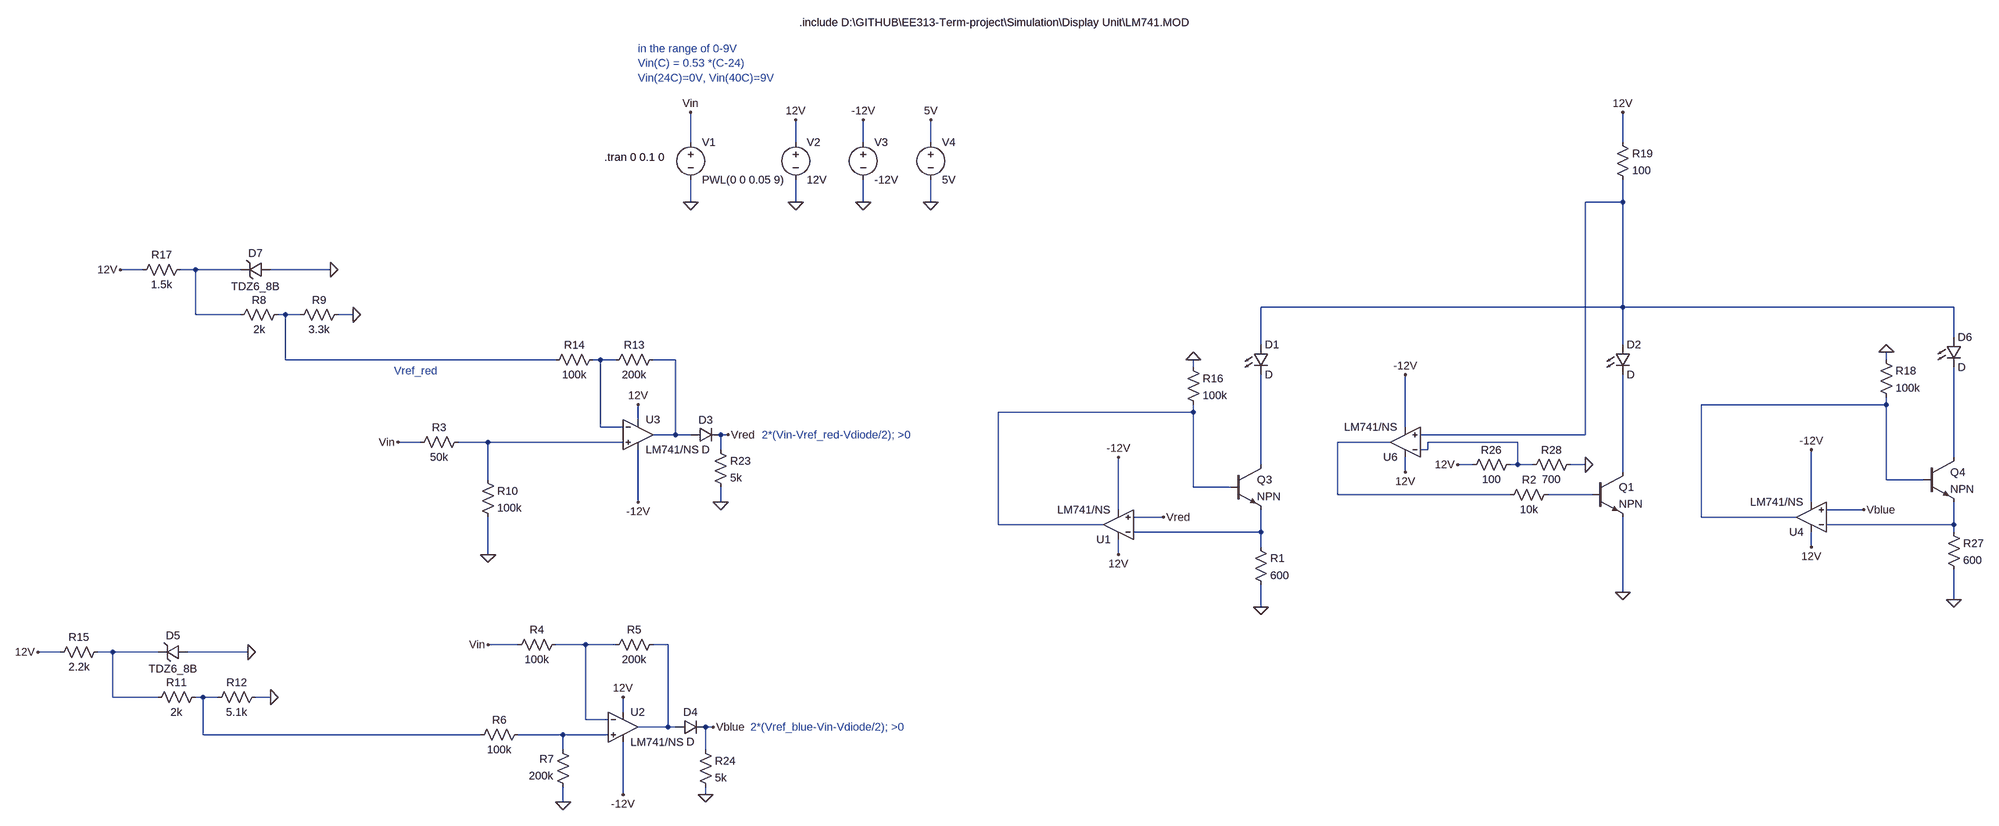
[diagram p0: schematic Display Unit.asc]
Display Unit.asc, the LTspice schematic file:
Version 4
SHEET 1 4272 2752
WIRE -912 320 -912 256
WIRE -688 320 -688 272
WIRE -544 320 -544 272
WIRE -400 320 -400 272
WIRE 1104 320 1104 256
WIRE -912 448 -912 400
WIRE -688 448 -688 400
WIRE -544 448 -544 400
WIRE -400 448 -400 400
WIRE 1104 448 1104 400
WIRE 1104 448 1024 448
WIRE -2080 592 -2128 592
WIRE -1968 592 -2000 592
WIRE -1872 592 -1968 592
WIRE -1680 592 -1808 592
WIRE 1104 672 1104 448
WIRE 1104 672 304 672
WIRE 2000 672 1104 672
WIRE -1968 688 -1968 592
WIRE -1872 688 -1968 688
WIRE -1776 688 -1792 688
WIRE -1744 688 -1776 688
WIRE -1632 688 -1664 688
WIRE 2000 736 2000 672
WIRE 304 752 304 672
WIRE 1104 752 1104 672
WIRE -1776 784 -1776 688
WIRE -1200 784 -1776 784
WIRE -1104 784 -1120 784
WIRE -1072 784 -1104 784
WIRE -944 784 -992 784
WIRE 1856 784 1856 768
WIRE 160 800 160 784
WIRE 1856 880 1856 864
WIRE 1856 880 1440 880
WIRE 160 896 160 880
WIRE 160 896 -256 896
WIRE -1024 912 -1024 880
WIRE -1104 928 -1104 784
WIRE -1056 928 -1104 928
WIRE 640 928 640 816
WIRE -944 944 -944 784
WIRE -944 944 -992 944
WIRE -912 944 -944 944
WIRE -832 944 -848 944
WIRE 1024 944 1024 448
WIRE 1024 944 672 944
WIRE -1488 960 -1536 960
WIRE -1344 960 -1408 960
WIRE -1056 960 -1344 960
WIRE 608 960 496 960
WIRE 880 960 688 960
WIRE -848 976 -848 944
WIRE 688 976 688 960
WIRE 688 976 672 976
WIRE 2000 992 2000 800
WIRE 304 1008 304 816
WIRE 784 1008 752 1008
WIRE 880 1008 880 960
WIRE 880 1008 864 1008
WIRE 912 1008 880 1008
WIRE 1024 1008 992 1008
WIRE 640 1024 640 992
WIRE 1104 1024 1104 816
WIRE -1344 1040 -1344 960
WIRE 1856 1040 1856 880
WIRE 1936 1040 1856 1040
WIRE 160 1056 160 896
WIRE 240 1056 160 1056
WIRE 496 1072 496 960
WIRE 864 1072 496 1072
WIRE 1040 1072 944 1072
WIRE -1024 1088 -1024 976
WIRE -848 1088 -848 1056
WIRE 1696 1088 1696 976
WIRE 0 1104 0 992
WIRE 1808 1104 1728 1104
WIRE 96 1120 32 1120
WIRE 1440 1120 1440 880
WIRE 1664 1120 1440 1120
WIRE -256 1136 -256 896
WIRE -32 1136 -256 1136
WIRE 2000 1136 2000 1088
WIRE 2000 1136 1728 1136
WIRE 304 1152 304 1104
WIRE 304 1152 32 1152
WIRE 2000 1152 2000 1136
WIRE 304 1184 304 1152
WIRE 1696 1184 1696 1152
WIRE -1344 1200 -1344 1120
WIRE 0 1200 0 1168
WIRE 1104 1280 1104 1120
WIRE 2000 1296 2000 1232
WIRE 304 1312 304 1264
WIRE -1280 1392 -1344 1392
WIRE -1136 1392 -1200 1392
WIRE -1072 1392 -1136 1392
WIRE -960 1392 -992 1392
WIRE -2256 1408 -2304 1408
WIRE -2144 1408 -2176 1408
WIRE -2048 1408 -2144 1408
WIRE -1856 1408 -1984 1408
WIRE -2144 1504 -2144 1408
WIRE -2048 1504 -2144 1504
WIRE -1952 1504 -1968 1504
WIRE -1920 1504 -1952 1504
WIRE -1808 1504 -1840 1504
WIRE -1056 1536 -1056 1504
WIRE -1136 1552 -1136 1392
WIRE -1088 1552 -1136 1552
WIRE -960 1568 -960 1392
WIRE -960 1568 -1024 1568
WIRE -944 1568 -960 1568
WIRE -864 1568 -880 1568
WIRE -1952 1584 -1952 1504
WIRE -1360 1584 -1952 1584
WIRE -1184 1584 -1280 1584
WIRE -1088 1584 -1184 1584
WIRE -1184 1616 -1184 1584
WIRE -880 1616 -880 1568
WIRE -1056 1712 -1056 1600
WIRE -880 1712 -880 1696
WIRE -1184 1728 -1184 1696
FLAG -912 448 0
FLAG -912 256 Vin
FLAG -688 448 0
FLAG -688 272 12V
FLAG 304 1312 0
FLAG -544 448 0
FLAG -544 272 -12V
FLAG -400 448 0
FLAG -400 272 5V
FLAG -1024 880 12V
FLAG -1344 1200 0
FLAG -832 944 Vred
FLAG -1536 960 Vin
FLAG -1056 1504 12V
FLAG -864 1568 Vblue
FLAG -1184 1728 0
FLAG -1344 1392 Vin
FLAG -1024 1088 -12V
FLAG -1056 1712 -12V
FLAG 2000 1296 0
FLAG -848 1088 0
FLAG -880 1712 0
FLAG 1104 256 12V
FLAG -1632 688 0
FLAG -1680 592 0
FLAG -2128 592 12V
FLAG 0 1200 12V
FLAG 0 992 -12V
FLAG -1808 1504 0
FLAG -1856 1408 0
FLAG -2304 1408 12V
FLAG 96 1120 Vred
FLAG 160 784 0
FLAG 1696 1184 12V
FLAG 1696 976 -12V
FLAG 1856 768 0
FLAG 1808 1104 Vblue
FLAG 640 1024 12V
FLAG 640 816 -12V
FLAG 1024 1008 0
FLAG 752 1008 12V
FLAG 1104 1280 0
SYMBOL voltage -912 304 R0
WINDOW 123 0 0 Left 0
WINDOW 39 0 0 Left 0
SYMATTR InstName V1
SYMATTR Value PWL(0 0 0.05 9)
SYMBOL voltage -688 304 R0
WINDOW 123 0 0 Left 0
WINDOW 39 0 0 Left 0
SYMATTR InstName V2
SYMATTR Value 12V
SYMBOL LED 288 752 R0
SYMATTR InstName D1
SYMBOL voltage -544 304 R0
WINDOW 123 0 0 Left 0
WINDOW 39 0 0 Left 0
SYMATTR InstName V3
SYMATTR Value -12V
SYMBOL voltage -400 304 R0
WINDOW 123 0 0 Left 0
WINDOW 39 0 0 Left 0
SYMATTR InstName V4
SYMATTR Value 5V
SYMBOL OpAmps\\opamp2 -1024 880 R0
SYMATTR InstName U3
SYMATTR Value LM741/NS
SYMBOL res -1360 1024 R0
SYMATTR InstName R10
SYMATTR Value 100k
SYMBOL res -976 768 R90
WINDOW 0 0 56 VBottom 2
WINDOW 3 32 56 VTop 2
SYMATTR InstName R13
SYMATTR Value 200k
SYMBOL res -1216 800 R270
WINDOW 0 32 56 VTop 2
WINDOW 3 0 56 VBottom 2
SYMATTR InstName R14
SYMATTR Value 100k
SYMBOL res -1392 944 R90
WINDOW 0 0 56 VBottom 2
WINDOW 3 32 56 VTop 2
SYMATTR InstName R3
SYMATTR Value 50k
SYMBOL OpAmps\\opamp2 -1056 1504 R0
SYMATTR InstName U2
SYMATTR Value LM741/NS
SYMBOL LED 1088 752 R0
SYMATTR InstName D2
SYMBOL res -1184 1376 R90
WINDOW 0 0 56 VBottom 2
WINDOW 3 32 56 VTop 2
SYMATTR InstName R4
SYMATTR Value 100k
SYMBOL res -976 1376 R90
WINDOW 0 0 56 VBottom 2
WINDOW 3 32 56 VTop 2
SYMATTR InstName R5
SYMATTR Value 200k
SYMBOL res -1264 1568 R90
WINDOW 0 0 56 VBottom 2
WINDOW 3 32 56 VTop 2
SYMATTR InstName R6
SYMATTR Value 100k
SYMBOL res -1168 1712 R180
WINDOW 0 36 76 Left 2
WINDOW 3 36 40 Left 2
SYMATTR InstName R7
SYMATTR Value 200k
SYMBOL diode -912 960 R270
WINDOW 0 32 32 VTop 2
WINDOW 3 0 32 VBottom 2
SYMATTR InstName D3
SYMBOL diode -944 1584 R270
WINDOW 0 32 32 VTop 2
WINDOW 3 0 32 VBottom 2
SYMATTR InstName D4
SYMBOL LED 1984 736 R0
SYMATTR InstName D6
SYMBOL res 1984 1136 R0
SYMATTR InstName R27
SYMATTR Value 600
SYMBOL res -864 960 R0
SYMATTR InstName R23
SYMATTR Value 5k
SYMBOL res -896 1600 R0
SYMATTR InstName R24
SYMATTR Value 5k
SYMBOL zener -1808 576 R90
WINDOW 0 -4 32 VBottom 2
WINDOW 3 36 32 VTop 2
SYMATTR InstName D7
SYMATTR Value TDZ6_8B
SYMBOL res -1776 672 R90
WINDOW 0 0 56 VBottom 2
WINDOW 3 32 56 VTop 2
SYMATTR InstName R8
SYMATTR Value 2k
SYMBOL res -1648 672 R90
WINDOW 0 0 56 VBottom 2
WINDOW 3 32 56 VTop 2
SYMATTR InstName R9
SYMATTR Value 3.3k
SYMBOL res -1984 576 R90
WINDOW 0 0 56 VBottom 2
WINDOW 3 32 56 VTop 2
SYMATTR InstName R17
SYMATTR Value 1.5k
SYMBOL OpAmps\\opamp2 0 1200 R180
SYMATTR InstName U1
SYMATTR Value LM741/NS
SYMBOL zener -1984 1392 R90
WINDOW 0 -4 32 VBottom 2
WINDOW 3 36 32 VTop 2
SYMATTR InstName D5
SYMATTR Value TDZ6_8B
SYMBOL res -1952 1488 R90
WINDOW 0 0 56 VBottom 2
WINDOW 3 32 56 VTop 2
SYMATTR InstName R11
SYMATTR Value 2k
SYMBOL res -1824 1488 R90
WINDOW 0 0 56 VBottom 2
WINDOW 3 32 56 VTop 2
SYMATTR InstName R12
SYMATTR Value 5.1k
SYMBOL res -2160 1392 R90
WINDOW 0 0 56 VBottom 2
WINDOW 3 32 56 VTop 2
SYMATTR InstName R15
SYMATTR Value 2.2k
SYMBOL res 144 784 R0
SYMATTR InstName R16
SYMATTR Value 100k
SYMBOL OpAmps\\opamp2 1696 1184 R180
SYMATTR InstName U4
SYMATTR Value LM741/NS
SYMBOL res 1840 768 R0
SYMATTR InstName R18
SYMATTR Value 100k
SYMBOL res 1088 304 R0
SYMATTR InstName R19
SYMATTR Value 100
SYMBOL res 288 1168 R0
SYMATTR InstName R1
SYMATTR Value 600
SYMBOL OpAmps\\opamp2 640 1024 R180
SYMATTR InstName U6
SYMATTR Value LM741/NS
SYMBOL res 880 992 R90
WINDOW 0 0 56 VBottom 2
WINDOW 3 32 56 VTop 2
SYMATTR InstName R26
SYMATTR Value 100
SYMBOL res 1008 992 R90
WINDOW 0 0 56 VBottom 2
WINDOW 3 32 56 VTop 2
SYMATTR InstName R28
SYMATTR Value 700
SYMBOL npn 240 1008 R0
SYMATTR InstName Q3
SYMBOL npn 1936 992 R0
SYMATTR InstName Q4
SYMBOL npn 1040 1024 R0
SYMATTR InstName Q1
SYMBOL res 960 1056 R90
WINDOW 0 0 56 VBottom 2
WINDOW 3 32 56 VTop 2
SYMATTR InstName R2
SYMATTR Value 10k
TEXT -680 64 Left 2 !.include D:\\GITHUB\\EE313-Term-project\\Simulation\\Display Unit\\LM741.MOD
TEXT -1096 352 Left 2 !.tran 0 0.1 0
TEXT -1024 120 Left 2 ;in the range of 0-9V\nVin(C) = 0.53 *(C-24)\nVin(24C)=0V, Vin(40C)=9V
TEXT -760 944 Left 2 ;2*(Vin-Vref_red-Vdiode/2); >0
TEXT -784 1568 Left 2 ;2*(Vref_blue-Vin-Vdiode/2); >0
TEXT -1544 808 Left 2 ;Vref_red

The netlist it stands for:
* Display Unit.asc
V1 Vin 0 PWL(0 0 0.05 9)
V2 12V 0 12V
D1 N001 N012 D
V3 -12V 0 -12V
V4 5V 0 5V
XU3 N008 N004 12V -12V N005 LM741/NS  ; pins In+ In- V+ V- OUT
R10 N008 0 100k
R13 N005 N004 200k
R14 N003 N004 100k
R3 N008 Vin 50k
XU2 N021 N017 12V -12V N018 LM741/NS  ; pins In+ In- V+ V- OUT
D2 N001 N013 D
R4 N017 Vin 100k
R5 N018 N017 200k
R6 N021 N020 100k
R7 0 N021 200k
D3 N005 Vred D
D4 N018 Vblue D
D6 N001 N011 D
R27 N015 0 600
R23 Vred 0 5k
R24 Vblue 0 5k
D7 0 N002 TDZ6_8B
R8 N003 N002 2k
R9 0 N003 3.3k
R17 N002 12V 1.5k
XU1 Vred N016 12V -12V N007 LM741/NS  ; pins In+ In- V+ V- OUT
D5 0 N019 TDZ6_8B
R11 N020 N019 2k
R12 0 N020 5.1k
R15 N019 12V 2.2k
R16 0 N007 100k
XU4 Vblue N015 12V -12V N006 LM741/NS  ; pins In+ In- V+ V- OUT
R18 0 N006 100k
R19 12V N001 100
R1 N016 0 600
XU6 N001 N010 12V -12V N009 LM741/NS  ; pins In+ In- V+ V- OUT
R26 N010 12V 100
R28 0 N010 700
Q3 N012 N007 N016 0 NPN
Q4 N011 N006 N015 0 NPN
Q1 N013 N014 0 0 NPN
R2 N014 N009 10k
.model D D
.lib standard.dio
.model NPN NPN
.model PNP PNP
.lib standard.bjt
.include D:\GITHUB\EE313-Term-project\Simulation\Display Unit\LM741.MOD
.tran 0 0.1 0
* in the range of 0-9V
* Vin(C) = 0.53 *(C-24)
* Vin(24C)=0V, Vin(40C)=9V
* 2*(Vin-Vref_red-Vdiode/2); >0
* 2*(Vref_blue-Vin-Vdiode/2); >0
* Vref_red
.backanno
.end